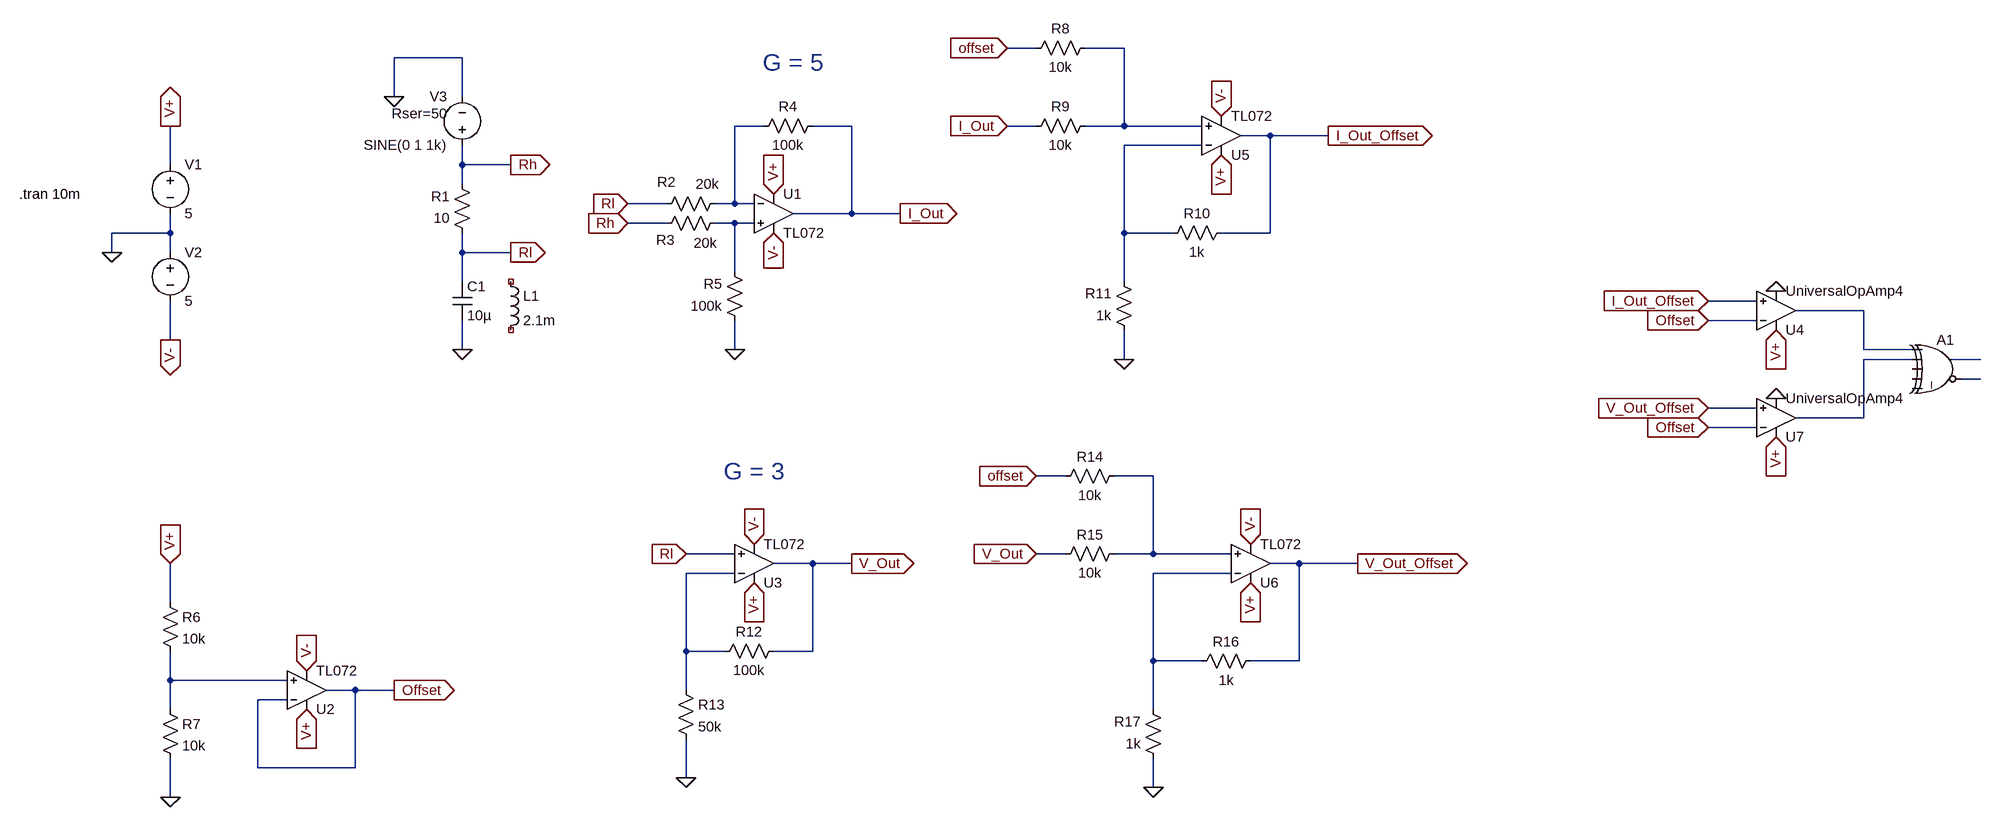
[diagram p0: schematic L-C.asc]
L-C.asc, the LTspice schematic file:
Version 4
SHEET 1 3188 996
WIRE 800 -320 752 -320
WIRE 944 -320 880 -320
WIRE -144 -304 -256 -304
WIRE -256 -240 -256 -304
WIRE -144 -240 -144 -304
WIRE 352 -192 304 -192
WIRE 496 -192 432 -192
WIRE 800 -192 752 -192
WIRE 944 -192 944 -320
WIRE 944 -192 880 -192
WIRE 1072 -192 944 -192
WIRE 1184 -176 1136 -176
WIRE 1280 -176 1184 -176
WIRE 1072 -160 944 -160
WIRE -624 -128 -624 -192
WIRE -144 -128 -144 -160
WIRE -64 -128 -144 -128
WIRE -144 -96 -144 -128
WIRE 192 -64 128 -64
WIRE 304 -64 304 -192
WIRE 304 -64 272 -64
WIRE 336 -64 304 -64
WIRE 496 -48 496 -192
WIRE 496 -48 400 -48
WIRE 576 -48 496 -48
WIRE 192 -32 128 -32
WIRE 304 -32 272 -32
WIRE 336 -32 304 -32
WIRE -624 -16 -624 -48
WIRE -624 -16 -720 -16
WIRE 944 -16 944 -160
WIRE 1024 -16 944 -16
WIRE 1184 -16 1184 -176
WIRE 1184 -16 1104 -16
WIRE -720 16 -720 -16
WIRE -624 16 -624 -16
WIRE -144 16 -144 -16
WIRE -64 16 -144 16
WIRE 304 48 304 -32
WIRE -144 64 -144 16
WIRE 944 64 944 -16
WIRE 1984 96 1904 96
WIRE 2160 112 2048 112
WIRE 1984 128 1904 128
WIRE -624 160 -624 96
WIRE -144 176 -144 128
WIRE 304 176 304 128
WIRE 2160 176 2160 112
WIRE 2240 176 2160 176
WIRE 944 192 944 144
WIRE 2240 192 2160 192
WIRE 2352 192 2304 192
WIRE 2352 224 2320 224
WIRE 1984 272 1904 272
WIRE 2160 288 2160 192
WIRE 2160 288 2048 288
WIRE 1984 304 1904 304
WIRE 848 384 800 384
WIRE 992 384 928 384
WIRE 304 512 224 512
WIRE 848 512 800 512
WIRE 992 512 992 384
WIRE 992 512 928 512
WIRE 1120 512 992 512
WIRE 432 528 368 528
WIRE 496 528 432 528
WIRE 1232 528 1184 528
WIRE 1328 528 1232 528
WIRE 304 544 224 544
WIRE 1120 544 992 544
WIRE -624 592 -624 528
WIRE 224 672 224 544
WIRE 288 672 224 672
WIRE 432 672 432 528
WIRE 432 672 368 672
WIRE 992 688 992 544
WIRE 1072 688 992 688
WIRE 1232 688 1232 528
WIRE 1232 688 1152 688
WIRE -624 720 -624 672
WIRE -432 720 -624 720
WIRE -320 736 -368 736
WIRE -256 736 -320 736
WIRE 224 736 224 672
WIRE -432 752 -480 752
WIRE -624 768 -624 720
WIRE 992 768 992 688
WIRE -480 864 -480 752
WIRE -320 864 -320 736
WIRE -320 864 -480 864
WIRE 224 880 224 816
WIRE 992 896 992 848
WIRE -624 912 -624 848
FLAG -720 16 0
FLAG -624 -192 V+
IOPIN -624 -192 Out
FLAG -624 160 V-
IOPIN -624 160 Out
FLAG -256 -240 0
FLAG -144 176 0
FLAG -64 -128 Rh
IOPIN -64 -128 Out
FLAG -64 16 Rl
IOPIN -64 16 Out
FLAG 368 -80 V+
IOPIN 368 -80 In
FLAG 368 -16 V-
IOPIN 368 -16 In
FLAG 304 176 0
FLAG 128 -32 Rh
IOPIN 128 -32 In
FLAG 128 -64 Rl
IOPIN 128 -64 In
FLAG 576 -48 I_Out
IOPIN 576 -48 Out
FLAG -400 768 V+
IOPIN -400 768 In
FLAG -400 704 V-
IOPIN -400 704 In
FLAG -624 912 0
FLAG -624 528 V+
IOPIN -624 528 In
FLAG -256 736 Offset
IOPIN -256 736 Out
FLAG 336 560 V+
IOPIN 336 560 In
FLAG 336 496 V-
IOPIN 336 496 In
FLAG 752 -320 offset
IOPIN 752 -320 In
FLAG 752 -192 I_Out
IOPIN 752 -192 In
FLAG 944 192 0
FLAG 1280 -176 I_Out_Offset
IOPIN 1280 -176 Out
FLAG 2016 144 V+
IOPIN 2016 144 In
FLAG 1904 96 I_Out_Offset
IOPIN 1904 96 In
FLAG 1904 128 Offset
IOPIN 1904 128 In
FLAG 2016 80 0
FLAG 224 512 Rl
IOPIN 224 512 In
FLAG 224 880 0
FLAG 496 528 V_Out
IOPIN 496 528 Out
FLAG 1104 -144 V+
IOPIN 1104 -144 In
FLAG 1104 -208 V-
IOPIN 1104 -208 In
FLAG 800 384 offset
IOPIN 800 384 In
FLAG 800 512 V_Out
IOPIN 800 512 In
FLAG 992 896 0
FLAG 1328 528 V_Out_Offset
IOPIN 1328 528 Out
FLAG 1152 560 V+
IOPIN 1152 560 In
FLAG 1152 496 V-
IOPIN 1152 496 In
FLAG 2016 320 V+
IOPIN 2016 320 In
FLAG 1904 272 V_Out_Offset
IOPIN 1904 272 In
FLAG 1904 304 Offset
IOPIN 1904 304 In
FLAG 2016 256 0
SYMBOL voltage -624 -144 R0
WINDOW 123 0 0 Left 0
WINDOW 39 0 0 Left 0
SYMATTR InstName V1
SYMATTR Value 5
SYMBOL voltage -624 0 R0
WINDOW 123 0 0 Left 0
WINDOW 39 0 0 Left 0
SYMATTR InstName V2
SYMATTR Value 5
SYMBOL ind -80 48 R0
SYMATTR InstName L1
SYMATTR Value 2.1m
SYMATTR SpiceLine Rser=2.57
SYMBOL res -128 0 R180
WINDOW 0 36 76 Left 2
WINDOW 3 36 40 Left 2
SYMATTR InstName R1
SYMATTR Value 10
SYMATTR SpiceLine tol=1
SYMBOL voltage -144 -144 R180
WINDOW 0 24 96 Left 2
WINDOW 3 24 16 Left 2
WINDOW 123 0 0 Left 0
WINDOW 39 24 68 Left 2
SYMATTR InstName V3
SYMATTR Value SINE(0 1 1k)
SYMATTR SpiceLine Rser=50
SYMBOL AutoGenerated\\TL072 368 -48 R0
SYMATTR InstName U1
SYMBOL res 288 -80 R90
WINDOW 0 -4 96 VBottom 2
WINDOW 3 -32 29 VTop 2
SYMATTR InstName R2
SYMATTR Value 20k
SYMBOL res 288 -48 R90
WINDOW 0 59 98 VBottom 2
WINDOW 3 33 32 VTop 2
SYMATTR InstName R3
SYMATTR Value 20k
SYMBOL res 448 -208 R90
WINDOW 0 0 56 VBottom 2
WINDOW 3 32 56 VTop 2
SYMATTR InstName R4
SYMATTR Value 100k
SYMBOL res 320 144 R180
WINDOW 0 36 76 Left 2
WINDOW 3 36 40 Left 2
SYMATTR InstName R5
SYMATTR Value 100k
SYMBOL AutoGenerated\\TL072 -400 736 M180
SYMATTR InstName U2
SYMBOL res -640 576 R0
SYMATTR InstName R6
SYMATTR Value 10k
SYMATTR SpiceLine tol=5
SYMBOL res -640 752 R0
SYMATTR InstName R7
SYMATTR Value 10k
SYMATTR SpiceLine tol=5
SYMBOL AutoGenerated\\TL072 336 528 M180
SYMATTR InstName U3
SYMBOL res 896 -336 R90
WINDOW 0 0 56 VBottom 2
WINDOW 3 32 56 VTop 2
SYMATTR InstName R8
SYMATTR Value 10k
SYMBOL res 896 -208 R90
WINDOW 0 0 56 VBottom 2
WINDOW 3 32 56 VTop 2
SYMATTR InstName R9
SYMATTR Value 10k
SYMBOL res 1120 -32 R90
WINDOW 0 0 56 VBottom 2
WINDOW 3 32 56 VTop 2
SYMATTR InstName R10
SYMATTR Value 1k
SYMATTR SpiceLine tol=1
SYMBOL res 960 160 R180
WINDOW 0 36 76 Left 2
WINDOW 3 36 40 Left 2
SYMATTR InstName R11
SYMATTR Value 1k
SYMATTR SpiceLine tol=1
SYMBOL Digital\\xor 2288 144 R0
SYMATTR InstName A1
SYMBOL res 384 656 R90
WINDOW 0 0 56 VBottom 2
WINDOW 3 32 56 VTop 2
SYMATTR InstName R12
SYMATTR Value 100k
SYMBOL res 208 720 R0
SYMATTR InstName R13
SYMATTR Value 50k
SYMBOL AutoGenerated\\TL072 1104 -176 M180
SYMATTR InstName U5
SYMBOL res 944 368 R90
WINDOW 0 0 56 VBottom 2
WINDOW 3 32 56 VTop 2
SYMATTR InstName R14
SYMATTR Value 10k
SYMBOL res 944 496 R90
WINDOW 0 0 56 VBottom 2
WINDOW 3 32 56 VTop 2
SYMATTR InstName R15
SYMATTR Value 10k
SYMBOL res 1168 672 R90
WINDOW 0 0 56 VBottom 2
WINDOW 3 32 56 VTop 2
SYMATTR InstName R16
SYMATTR Value 1k
SYMATTR SpiceLine tol=1
SYMBOL res 1008 864 R180
WINDOW 0 36 76 Left 2
WINDOW 3 36 40 Left 2
SYMATTR InstName R17
SYMATTR Value 1k
SYMATTR SpiceLine tol=1
SYMBOL AutoGenerated\\TL072 1152 528 M180
SYMATTR InstName U6
SYMBOL cap -160 64 R0
SYMATTR InstName C1
SYMATTR Value 10µ
SYMBOL OpAmps\\UniversalOpAmp4 2016 112 M180
SYMATTR InstName U4
SYMBOL OpAmps\\UniversalOpAmp4 2016 288 M180
SYMATTR InstName U7
TEXT -872 -80 Left 2 !.tran 10m
TEXT 400 -296 Center 4 ;G = 5
TEXT 336 376 Center 4 ;G = 3

The netlist it stands for:
* L-C.asc
V1 V+ 0 5
V2 0 V- 5
L1 NC_01 NC_02 2.1m Rser=2.57
R1 Rl Rh 10 tol=1
V3 Rh 0 SINE(0 1 1k) Rser=50
* U1: TL072 (symbol AutoGenerated\TL072 not available, pins judged from their places): In+=N004 In-=N002 V+=V+ V-=V- OUT=I_Out
R2 N002 Rl 20k
R3 N004 Rh 20k
R4 I_Out N002 100k
R5 0 N004 100k
* U2: TL072 (symbol AutoGenerated\TL072 not available, pins judged from their places): In+=N012 In-=Offset V+=V+ V-=V- OUT=Offset
R6 V+ N012 10k tol=5
R7 N012 0 10k tol=5
* U3: TL072 (symbol AutoGenerated\TL072 not available, pins judged from their places): In+=Rl In-=N010 V+=V+ V-=V- OUT=V_Out
R8 N001 Offset 10k
R9 N001 I_Out 10k
R10 I_Out_Offset N003 1k tol=1
R11 0 N003 1k tol=1
A1 N005 N006 0 0 0 N008 N007 0 XOR
R12 V_Out N010 100k
R13 N010 0 50k
* U5: TL072 (symbol AutoGenerated\TL072 not available, pins judged from their places): In+=N001 In-=N003 V+=V+ V-=V- OUT=I_Out_Offset
R14 N009 Offset 10k
R15 N009 V_Out 10k
R16 V_Out_Offset N011 1k tol=1
R17 0 N011 1k tol=1
* U6: TL072 (symbol AutoGenerated\TL072 not available, pins judged from their places): In+=N009 In-=N011 V+=V+ V-=V- OUT=V_Out_Offset
C1 Rl 0 10µ
* U4: UniversalOpAmp4 (symbol OpAmps\UniversalOpAmp4 not available, pins judged from their places): In+=I_Out_Offset In-=Offset V+=V+ V-=0 OUT=N005
* U7: UniversalOpAmp4 (symbol OpAmps\UniversalOpAmp4 not available, pins judged from their places): In+=V_Out_Offset In-=Offset V+=V+ V-=0 OUT=N006
.tran 10m
* G = 5
* G = 3
.backanno
.end